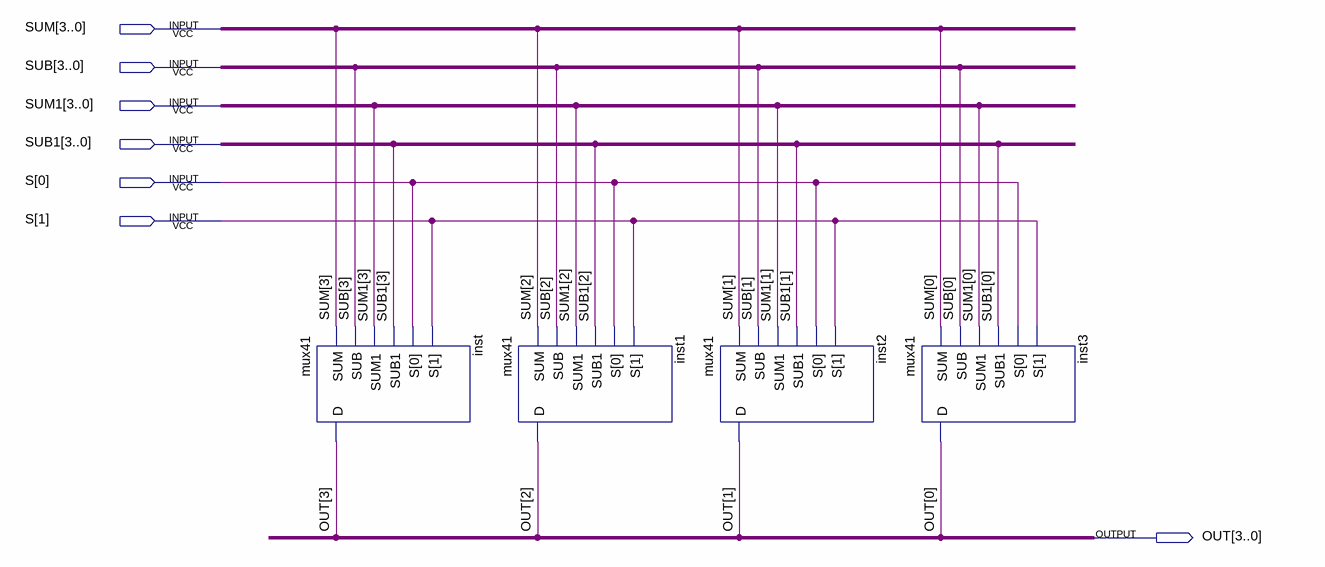
[diagram p0: schematic sheet]
// Quartus schematic 4BITMUX4.bdf as structural Verilog: 4 symbols, 7 pins
module \4BITMUX4  (
  input  [3:0] SUM,
  input  [3:0] SUB,
  input  [3:0] SUM1,
  input  [3:0] SUB1,
  input  [1:0] S,
  output [3:0] OUT
);

  mux41 inst (.SUM(SUM[3]), .SUB(SUB[3]), .SUM1(SUM1[3]), .SUB1(SUB1[3]), .S(S), .D(OUT[3]));
  mux41 inst1 (.SUM(SUM[2]), .SUB(SUB[2]), .SUM1(SUM1[2]), .SUB1(SUB1[2]), .S(S), .D(OUT[2]));
  mux41 inst2 (.SUM(SUM[1]), .SUB(SUB[1]), .SUM1(SUM1[1]), .SUB1(SUB1[1]), .S(S), .D(OUT[1]));
  mux41 inst3 (.SUM(SUM[0]), .SUB(SUB[0]), .SUM1(SUM1[0]), .SUB1(SUB1[0]), .S(S), .D(OUT[0]));
endmodule
